# Altium schematic sheet Connectors.SchDoc
size A4
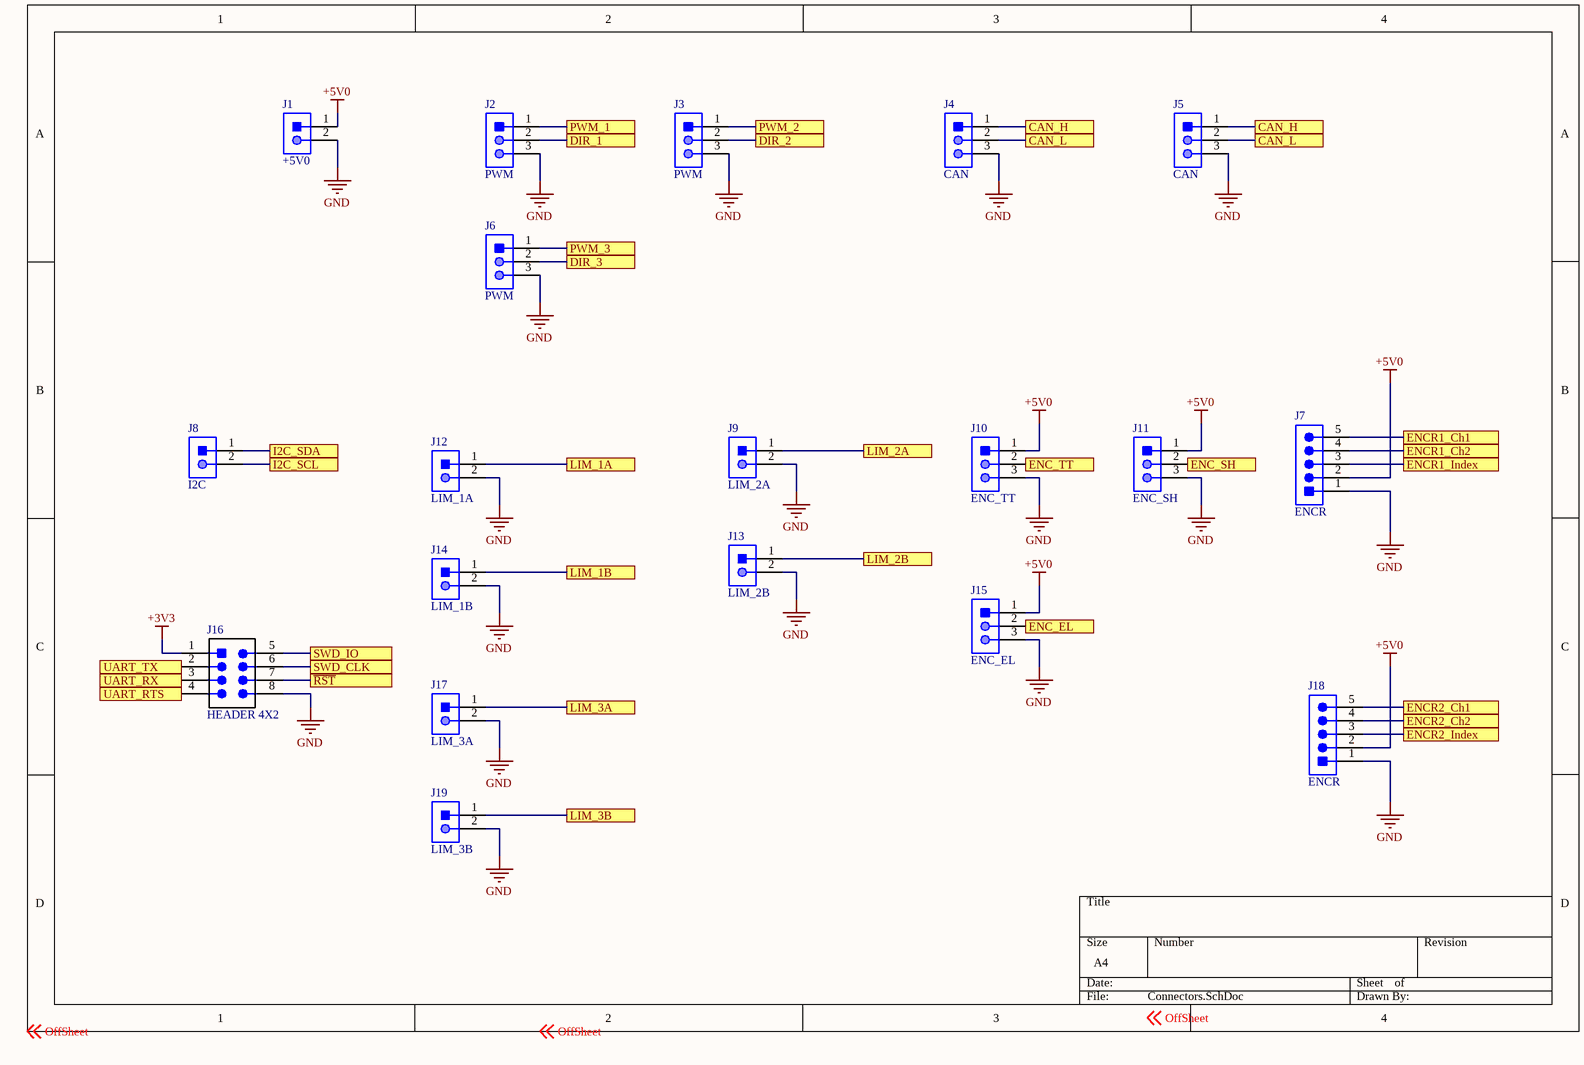
[diagram p0: Connectors.SchDoc]

## Parts
J1  +5V0  [JST-B2B-SM4-TB]
J2  PWM  [JST-B3B-SM4-TB]
J3  PWM  [JST-B3B-SM4-TB]
J4  CAN  [JST-B3B-SM4-TB]
J5  CAN  [JST-B3B-SM4-TB]
J6  PWM  [JST-B3B-SM4-TB]
J7  ENCR  [JST-B5B-SM4-TB]
J8  I2C  [JST-B2B-SM4-TB]
J9  LIM_2A  [JST-B2B-SM4-TB]
J10  ENC_TT  [JST-B3B-SM4-TB]
J11  ENC_SH  [JST-B3B-SM4-TB]
J12  LIM_1A  [JST-B2B-SM4-TB]
J13  LIM_2B  [JST-B2B-SM4-TB]
J14  LIM_1B  [JST-B2B-SM4-TB]
J15  ENC_EL  [JST-B3B-SM4-TB]
J16  HEADER 4X2  [HEADER_2X4]
J17  LIM_3A  [JST-B2B-SM4-TB]
J18  ENCR  [JST-B5B-SM4-TB]
J19  LIM_3B  [JST-B2B-SM4-TB]

## Ports
CAN_H, CAN_L, DIR_1, DIR_2, DIR_3, ENC_EL, ENC_SH, ENC_TT, ENCR1_Ch1, ENCR1_Ch2, ENCR1_Index, ENCR2_Ch1, ENCR2_Ch2, ENCR2_Index, I2C_SCL, I2C_SDA, LIM_1A, LIM_1B, LIM_2A, LIM_2B, LIM_3A, LIM_3B, PWM_1, PWM_2, PWM_3, SWD_CLK, SWD_IO, UART_RTS, UART_RX, UART_TX, ~{RST}

## Nets
+3V3: J16.1(VCC)
+5V0: J1.1 J7.2 J10.1 J11.1 J15.1 J18.2
GND: J1.2 J2.3 J3.3 J4.3 J5.3 J6.3 J7.1 J9.2 J10.3 J11.3 J12.2 J13.2 J14.2 J15.3 J16.8 J17.2 J18.1 J19.2
~{RST}: J16.7 ; port ~{RST}
CAN_H: J4.1 J5.1 ; port CAN_H
CAN_L: J4.2 J5.2 ; port CAN_L
DIR_1: J2.2 ; port DIR_1
DIR_2: J3.2 ; port DIR_2
DIR_3: J6.2 ; port DIR_3
ENC_EL: J15.2 ; port ENC_EL
ENC_SH: J11.2 ; port ENC_SH
ENC_TT: J10.2 ; port ENC_TT
ENCR1_Ch1: J7.5 ; port ENCR1_Ch1
ENCR1_Ch2: J7.4 ; port ENCR1_Ch2
ENCR1_Index: J7.3 ; port ENCR1_Index
ENCR2_Ch1: J18.5 ; port ENCR2_Ch1
ENCR2_Ch2: J18.4 ; port ENCR2_Ch2
ENCR2_Index: J18.3 ; port ENCR2_Index
I2C_SCL: J8.2 ; port I2C_SCL
I2C_SDA: J8.1 ; port I2C_SDA
LIM_1A: J12.1 ; port LIM_1A
LIM_1B: J14.1 ; port LIM_1B
LIM_2A: J9.1 ; port LIM_2A
LIM_2B: J13.1 ; port LIM_2B
LIM_3A: J17.1 ; port LIM_3A
LIM_3B: J19.1 ; port LIM_3B
PWM_1: J2.1 ; port PWM_1
PWM_2: J3.1 ; port PWM_2
PWM_3: J6.1 ; port PWM_3
SWD_CLK: J16.6 ; port SWD_CLK
SWD_IO: J16.5(GND) ; port SWD_IO
UART_RTS: J16.4 ; port UART_RTS
UART_RX: J16.3 ; port UART_RX
UART_TX: J16.2 ; port UART_TX

## Notes on the sheet
- Labels drawn without touching a wire or pin: OffSheet

## Library data of the parts
J1 J8 J9 J12-J14 J17 J19 = CON_2M_PH_TOP_SMT: CONN HEADER PH TOP 2POS 2MM SMD; Manufacturer: JST; MPN: B2B-PH-SM4-TB; ComponentLink1Description: Datasheet; ComponentLink1URL: http://www.jst-mfg.com/product/pdf/eng/ePH.pdf; Digikey Part Number: 455-1734-1-ND
J2-J6 J10 J11 J15 = CON_3M_PH_TOP_SMT: CONN HEADER PH TOP 3POS 2MM SMD; Manufacturer: JST; MPN: B3B-PH-SM4-TB(LF)(SN); ComponentLink1Description: Datasheet; ComponentLink1URL: http://www.jst-mfg.com/product/pdf/eng/ePH.pdf; Digikey Part Number: 455-1735-1-ND
J7 J18 = CON_5M_PH_TOP_SMT: CONN HEADER PH TOP 5POS 2MM SMD; Manufacturer: JST; MPN: B5B-PH-SM4-TB(LF)(SN); ComponentLink1Description: Datasheet; ComponentLink1URL: http://www.jst-mfg.com/product/pdf/eng/ePH.pdf; Digikey Part Number: 455-1737-1-ND
J16 = HEADER 4X2: Header, 4-Pin Dual row; MPN: GRPB042VWVN-RC; Manufacturer: Sullins Connector Solutions; Digikey Part Number: S9015E-04-ND